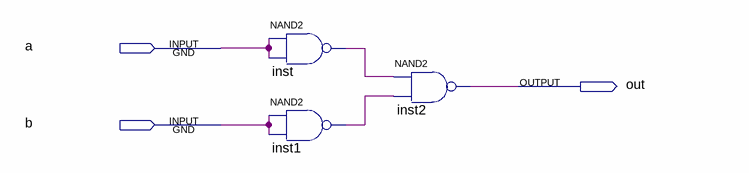
[diagram p0: schematic sheet]
// Quartus schematic Or.bdf as structural Verilog: 3 symbols, 3 pins
module Or (
  input  a,
  input  b,
  output out
);

  wire inst1_out, inst_out;

  nand inst (inst_out, a, a);
  nand inst1 (inst1_out, b, b);
  nand inst2 (out, inst_out, inst1_out);
endmodule
